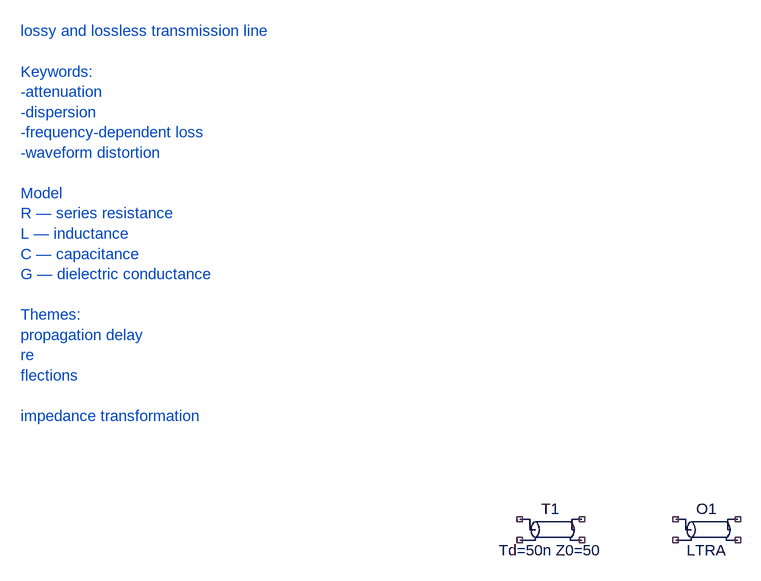
[diagram p0: schematic Draft2.asc]
Draft2.asc, the LTspice schematic file:
Version 4.1
SHEET 1 880 680
SYMBOL ltline 192 176 R0
SYMATTR InstName O1
SYMBOL tline -48 176 R0
SYMATTR InstName T1
TEXT -864 -592 Left 2 ;lossy and lossless transmission line\n \nKeywords: \n-attenuation\n-dispersion\n-frequency-dependent loss\n-waveform distortion\n \nModel\nR — series resistance\nL — inductance\nC — capacitance\nG — dielectric conductance\n \nThemes: \npropagation delay\nre\nflections\n\nimpedance transformation

The netlist it stands for:
* Draft2.asc
O1 NC_01 NC_02 NC_03 NC_04 LTRA
T1 NC_05 NC_06 NC_07 NC_08 Td=50n Z0=50
* lossy and lossless transmission line
* Keywords:
* -attenuation
* -dispersion
* -frequency-dependent loss
* -waveform distortion
* Model
* R — series resistance
* L — inductance
* C — capacitance
* G — dielectric conductance
* Themes:
* propagation delay
* re
* flections
* impedance transformation
.backanno
.end